# EasyEDA schematic Solder v2.json
TITLE: Sheet_1; REV: 1.0; Date: 2025-04-23; Sheet: 1/1; Company: Your Company
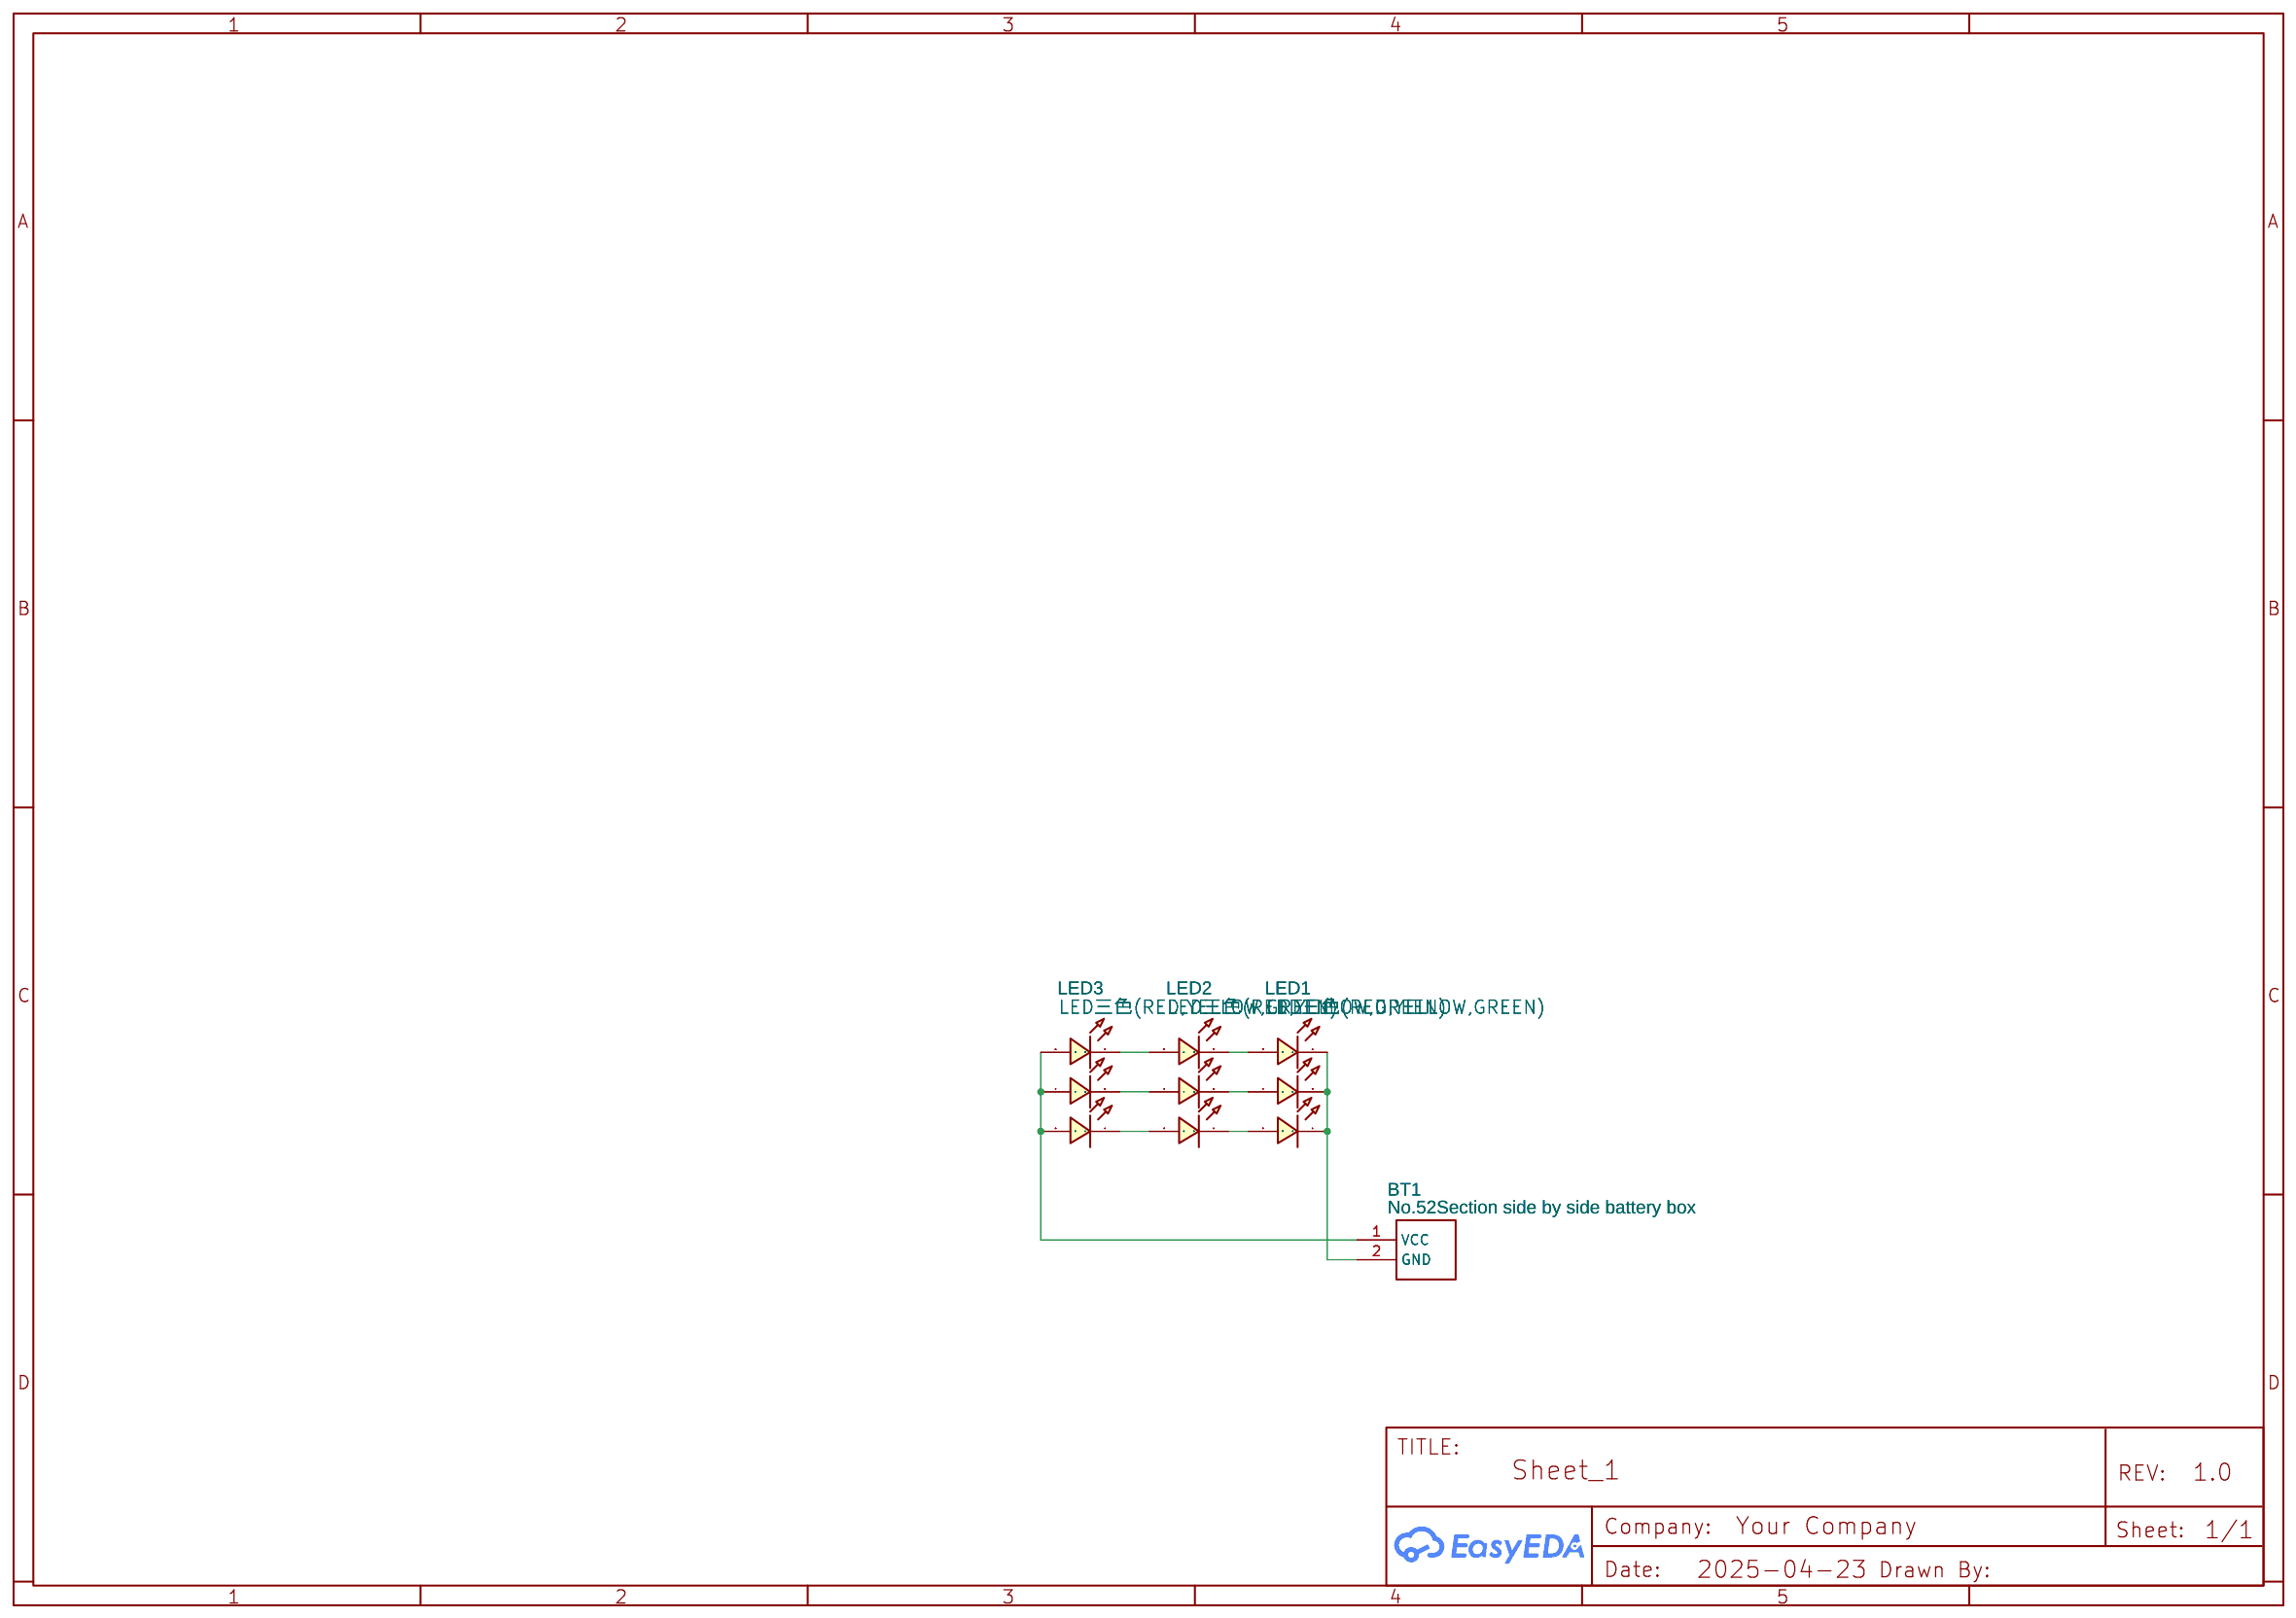
[diagram p0: schematic sheet]

## Parts
BT1  No.52Section side by side battery box  [BAT-TH_BC2AA]
LED1  LED三色(RED,YELLOW,GREEN)  [LED-TH_6P_LED4GREEN]
LED2  LED三色(RED,YELLOW,GREEN)  [LED-TH_6P_LED4GREEN]
LED3  LED三色(RED,YELLOW,GREEN)  [LED-TH_6P_LED4GREEN]

## Library data of the parts
BT1 = No.52Section side by side battery box: Supplier: LCSC; Manufacturer: 国产; Manufacturer Part: 五号2节并列电池盒; Supplier Part: C5404; JLCPCB Part Class: Extended Part
LED1-LED3 = LED三色(RED,YELLOW,GREEN): Contributor: lcsc; Supplier: LCSC; Supplier Part: C9900027004; Manufacturer: null; Manufacturer Part: LED三色(Red,Yellow,Green)

## Nets
Net-(BT1-1): BT1.1(VCC) LED3.2 LED3.4 LED3.6
Net-(BT1-2): BT1.2(GND) LED1.1 LED1.3 LED1.5
Net-(LED1-2): LED1.2 LED2.1
Net-(LED1-4): LED1.4 LED2.3
Net-(LED1-6): LED1.6 LED2.5
Net-(LED2-2): LED2.2 LED3.1
Net-(LED2-4): LED2.4 LED3.3
Net-(LED2-6): LED2.6 LED3.5
